# EAGLE design PCB-BI16-466 (EAGLE 7.5.0)

## Sheet 1 of 2
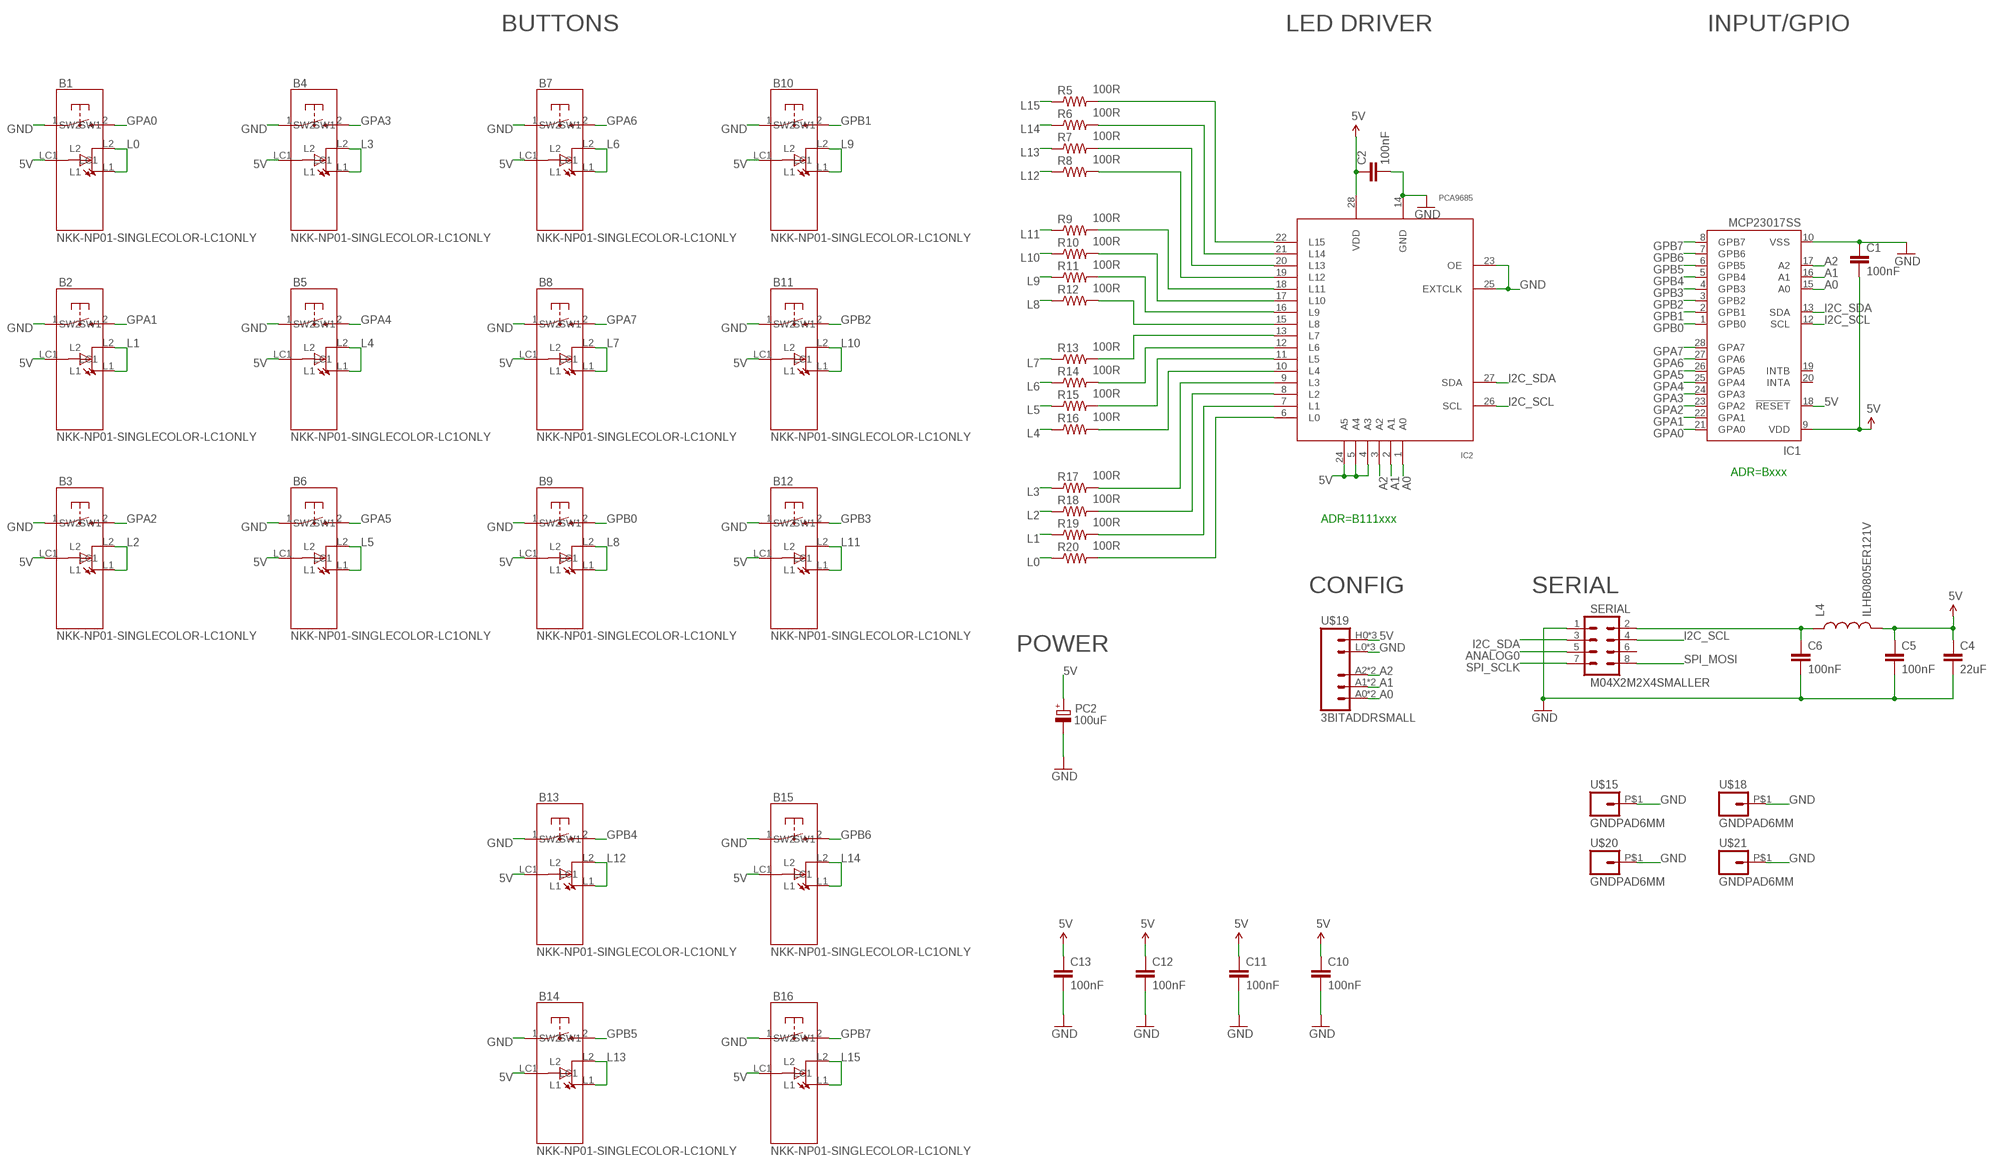
[diagram p0: schematic, sheet 1]

### Parts
B1  NKK-NP01-SINGLECOLOR-LC1ONLY  [NKK-NP01_LESSHOLES2]
B2  NKK-NP01-SINGLECOLOR-LC1ONLY  [NKK-NP01_LESSHOLES2]
B3  NKK-NP01-SINGLECOLOR-LC1ONLY  [NKK-NP01_LESSHOLES2]
B4  NKK-NP01-SINGLECOLOR-LC1ONLY  [NKK-NP01_LESSHOLES2]
B5  NKK-NP01-SINGLECOLOR-LC1ONLY  [NKK-NP01_LESSHOLES2]
B6  NKK-NP01-SINGLECOLOR-LC1ONLY  [NKK-NP01_LESSHOLES2]
B7  NKK-NP01-SINGLECOLOR-LC1ONLY  [NKK-NP01_LESSHOLES2]
B8  NKK-NP01-SINGLECOLOR-LC1ONLY  [NKK-NP01_LESSHOLES2]
B9  NKK-NP01-SINGLECOLOR-LC1ONLY  [NKK-NP01_LESSHOLES2]
B10  NKK-NP01-SINGLECOLOR-LC1ONLY  [NKK-NP01_LESSHOLES2]
B11  NKK-NP01-SINGLECOLOR-LC1ONLY  [NKK-NP01_LESSHOLES2]
B12  NKK-NP01-SINGLECOLOR-LC1ONLY  [NKK-NP01_LESSHOLES2]
B13  NKK-NP01-SINGLECOLOR-LC1ONLY  [NKK-NP01_LESSHOLES2]
B14  NKK-NP01-SINGLECOLOR-LC1ONLY  [NKK-NP01_LESSHOLES2]
B15  NKK-NP01-SINGLECOLOR-LC1ONLY  [NKK-NP01_LESSHOLES2]
B16  NKK-NP01-SINGLECOLOR-LC1ONLY  [NKK-NP01_LESSHOLES2]
C1  100nF  CAP0603-CAP  [0603-CAP]
C2  100nF  CAP0603-CAP  [0603-CAP]
C4  22uF  CAP0805  [0805]
C5  100nF  CAP0603-CAP  [0603-CAP]
C6  100nF  CAP0603-CAP  [0603-CAP]
C10  100nF  CAP0603-CAP  [0603-CAP]
C11  100nF  CAP0603-CAP  [0603-CAP]
C12  100nF  CAP0603-CAP  [0603-CAP]
C13  100nF  CAP0603-CAP  [0603-CAP]
IC1  MCP23017SS  [SSOP28]
IC2  PCA9685  [TSSOP28]
L4  ILHB0805ER121V  INDUCTOR0805  [0805]
PC2  100uF  CPOL-EUD  [PANASONIC_D]
R5  100R  RESISTOR0603-RES  [0603-RES]
R6  100R  RESISTOR0603-RES  [0603-RES]
R7  100R  RESISTOR0603-RES  [0603-RES]
R8  100R  RESISTOR0603-RES  [0603-RES]
R9  100R  RESISTOR0603-RES  [0603-RES]
R10  100R  RESISTOR0603-RES  [0603-RES]
R11  100R  RESISTOR0603-RES  [0603-RES]
R12  100R  RESISTOR0603-RES  [0603-RES]
R13  100R  RESISTOR0603-RES  [0603-RES]
R14  100R  RESISTOR0603-RES  [0603-RES]
R15  100R  RESISTOR0603-RES  [0603-RES]
R16  100R  RESISTOR0603-RES  [0603-RES]
R17  100R  RESISTOR0603-RES  [0603-RES]
R18  100R  RESISTOR0603-RES  [0603-RES]
R19  100R  RESISTOR0603-RES  [0603-RES]
R20  100R  RESISTOR0603-RES  [0603-RES]
SERIAL  M04X2M2X4SMALLER  [M2X4SMALLER]
U$15  GNDPAD6MM  [3.2MMPAD6MM]
U$18  GNDPAD6MM  [3.2MMPAD6MM]
U$19  3BITADDRSMALL  [3BITADDR_SMALL]
U$20  GNDPAD6MM  [3.2MMPAD6MM]
U$21  GNDPAD6MM  [3.2MMPAD6MM]

### Nets
5V [Power]: B1.LC1 B2.LC1 B3.LC1 B4.LC1 B5.LC1 B6.LC1 B7.LC1 B8.LC1 B9.LC1 B10.LC1 B11.LC1 B12.LC1 B13.LC1 B14.LC1 B15.LC1 B16.LC1 C1.2 C2.1 C4.1 C5.1 C10.1 C11.1 C12.1 C13.1 IC1.9(VDD) IC1.18(!RESET) IC2.4(A3) IC2.5(A4) IC2.24(A5) IC2.28(VDD) L4.2 PC2.+ U$19.H0(VCC) U$19.H1(VCC) U$19.H2(VCC)
A0: IC1.15(A0) IC2.1(A0) U$19.A0 U$19.AS0(A0)
A1: IC1.16(A1) IC2.2(A1) U$19.A1 U$19.AS1(A1)
A2: IC1.17(A2) IC2.3(A2) U$19.A2 U$19.AS2(A2)
ANALOG0: SERIAL.5
GND [Power]: B1.1(SW1) B2.1(SW1) B3.1(SW1) B4.1(SW1) B5.1(SW1) B6.1(SW1) B7.1(SW1) B8.1(SW1) B9.1(SW1) B10.1(SW1) B11.1(SW1) B12.1(SW1) B13.1(SW1) B14.1(SW1) B15.1(SW1) B16.1(SW1) C1.1 C2.2 C4.2 C5.2 C6.2 C10.2 C11.2 C12.2 C13.2 IC1.10(VSS) IC2.14(GND) IC2.23(OE) IC2.25(EXTCLK) PC2.- SERIAL.1 U$15.P$1 U$18.P$1 U$19.L0(GND) U$19.L1(GND) U$19.L2(GND) U$20.P$1 U$21.P$1
GPA0: B1.2(SW2) IC1.21(GPA0)
GPA1: B2.2(SW2) IC1.22(GPA1)
GPA2: B3.2(SW2) IC1.23(GPA2)
GPA3: B4.2(SW2) IC1.24(GPA3)
GPA4: B5.2(SW2) IC1.25(GPA4)
GPA5: B6.2(SW2) IC1.26(GPA5)
GPA6: B7.2(SW2) IC1.27(GPA6)
GPA7: B8.2(SW2) IC1.28(GPA7)
GPB0 [Power]: B9.2(SW2) IC1.1(GPB0)
GPB1: B10.2(SW2) IC1.2(GPB1)
GPB2: B11.2(SW2) IC1.3(GPB2)
GPB3: B12.2(SW2) IC1.4(GPB3)
GPB4: B13.2(SW2) IC1.5(GPB4)
GPB5: B14.2(SW2) IC1.6(GPB5)
GPB6: B15.2(SW2) IC1.7(GPB6)
GPB7: B16.2(SW2) IC1.8(GPB7)
I2C_SCL: IC1.12(SCL) IC2.26(SCL) SERIAL.4
I2C_SDA: IC1.13(SDA) IC2.27(SDA) SERIAL.3
L0: B1.L1 B1.L2 R20.1
L1: B2.L1 B2.L2 R19.1
L2: B3.L1 B3.L2 R18.1
L3: B4.L1 B4.L2 R17.1
L4: B5.L1 B5.L2 R16.1
L5: B6.L1 B6.L2 R15.1
L6: B7.L1 B7.L2 R14.1
L7: B8.L1 B8.L2 R13.1
L8: B9.L1 B9.L2 R12.1
L9: B10.L1 B10.L2 R11.1
L10: B11.L1 B11.L2 R10.1
L11: B12.L1 B12.L2 R9.1
L12: B13.L1 B13.L2 R8.1
L13: B14.L1 B14.L2 R7.1
L14: B15.L1 B15.L2 R6.1
L15: B16.L1 B16.L2 R5.1
N$1 [Power]: C6.1 L4.1 SERIAL.2
N$4: IC2.13(L7) R13.2
N$5: IC2.12(L6) R14.2
N$7: IC2.11(L5) R15.2
N$9: IC2.10(L4) R16.2
N$10: IC2.9(L3) R17.2
N$11: IC2.8(L2) R18.2
N$12: IC2.7(L1) R19.2
N$19: IC2.6(L0) R20.2
N$20: IC2.15(L8) R12.2
N$21: IC2.16(L9) R11.2
N$22: IC2.17(L10) R10.2
N$23: IC2.18(L11) R9.2
N$24: IC2.19(L12) R8.2
N$25: IC2.20(L13) R7.2
N$26: IC2.21(L14) R6.2
N$27: IC2.22(L15) R5.2
SPI_MOSI: SERIAL.8
SPI_SCLK: SERIAL.7
Unconnected: IC1.19(INTB) IC1.20(INTA) SERIAL.6

### Notes on the sheet
- BUTTONS | LED DRIVER | INPUT/GPIO
- ADR=Bxxx
- ADR=B111xxx
- CONFIG | SERIAL
- POWER

## Sheet 2 of 2

## Library data of the parts
B1-B16 = SKAARHOJ:NKK-NP01-SINGLECOLOR-LC1ONLY
C1 C2 C4-C6 C10-C13 = SparkFun:CAP: Capacitor Standard 0603 ceramic capacitor, and 0.1" leaded capacitor.
IC1 = microchip:MCP23017: http://ww1.microchip.com/downloads/en/DeviceDoc/21952a.pdf Source: http://ww1.microchip.com/downloads/en/DeviceDoc/21952a.pdf; MF: MICROCHIP; MPN: MCP23017-E/SS; OC_FARNELL: 1467674; OC_NEWARK: 31K2960
IC2 = wsmith:PCA9685
L4 = SparkFun:INDUCTOR: Inductors Basic Inductor/Choke - 0603 and 1206. Footprints are not proven and vary greatly between part numbers.
PC2 = rcl:CPOL-EU: POLARIZED CAPACITOR, European symbol
R5-R20 = SparkFun:RESISTOR: Resistor Basic schematic elements and footprints for 0603, 1206, and PTH resistors.
SERIAL = SKAARHOJ:M04X2
U$15 U$18 U$20 U$21 = SKAARHOJ:GNDPAD
U$19 = SKAARHOJ:3BITADDR

## Net classes
0 default: width 0.203 mm, drill 0.305 mm, clearance 0.203 mm
1 Power: width 0.406 mm, drill 0.61 mm, clearance 0.254 mm

## Board
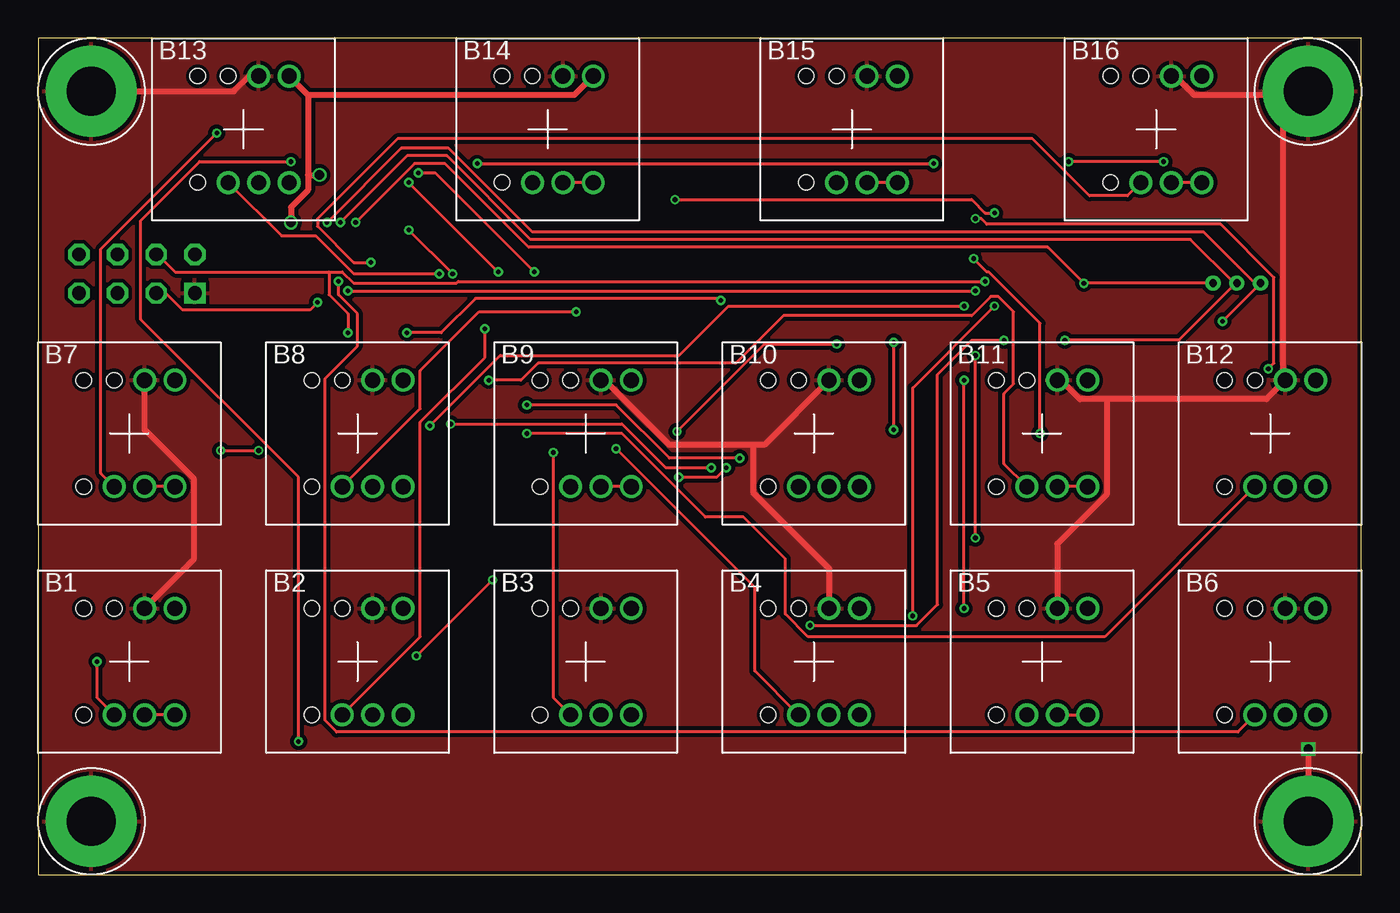
[diagram p1: board, top side]
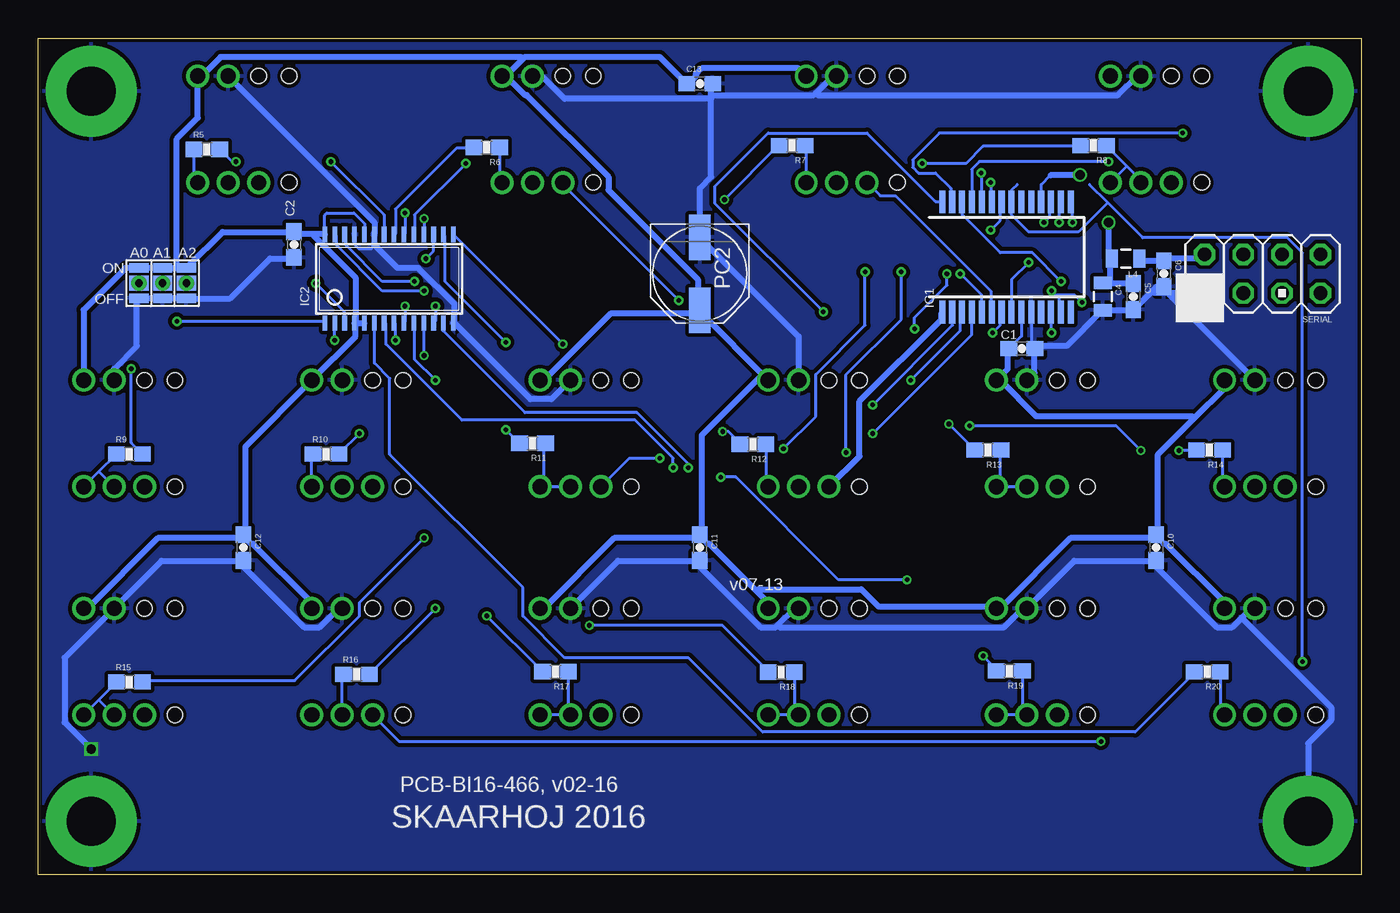
[diagram p2: board, bottom side, seen from below]

Size 87 x 55 mm. Coordinates in mm from the lower left corner, seen from the top.
Outline: 0,0 87,0 87,55 0,55 0,0
Copper layers (1*16): Top 0.035mm / dielectric 1.5mm / Bottom 0.035mm
Design rules "Fusion_eagle_rule_v1.1": minimum track width 6mil, minimum drill 12mil, track to track 6mil, track to pad 6mil, pad to pad 6mil, via to via 6mil, smd to smd 0mil, copper to edge 10mil, drill to drill 10mil, minimum pad ring 10mil, minimum via ring 6mil, stop-mask expansion 2mil, vias tented up to drill 100mil, thermal gap 10mil

### Footprints (pad centres in the part's own frame; a part is rotated, then mirrored left to right if it is on the bottom)
NKK-NP01_LESSHOLES2 = drill 1: 1 1,3.5; 2 -1,-3.5; L1 3,-3.5; L2 1,-3.5; LC1 3,3.5 | hole 1: -3,3.5; -3,-3.5; -1,3.5
0603-CAP = smd 1.1 x 1: 1 -0.85,0; 2 0.85,0
0805 = smd 0.8 x 1.2: 1 -0.9,0; 2 0.9,0
SSOP28 = smd 0.4 x 1.5: 1 -4.225,-3.625; 2 -3.575,-3.625; 3 -2.925,-3.625; 4 -2.275,-3.625; 5 -1.625,-3.625; 6 -0.975,-3.625; 7 -0.325,-3.625; 8 0.325,-3.625; 9 0.975,-3.625; 10 1.625,-3.625; 11 2.275,-3.625; 12 2.925,-3.625; 13 3.575,-3.625; 14 4.225,-3.625; 15 4.225,3.625; 16 3.575,3.625; 17 2.925,3.625; 18 2.275,3.625; 19 1.625,3.625; 20 0.975,3.625; 21 0.325,3.625; 22 -0.325,3.625; 23 -0.975,3.625; 24 -1.625,3.625; 25 -2.275,3.625; 26 -2.925,3.625; 27 -3.575,3.625; 28 -4.225,3.625
TSSOP28 = smd 0.305 x 0.991: 1 -4.225,-2.918; 2 -3.575,-2.918; 3 -2.925,-2.918; 4 -2.275,-2.918; 5 -1.625,-2.918; 6 -0.975,-2.918; 7 -0.325,-2.918; 8 0.325,-2.918; 9 0.975,-2.918; 10 1.625,-2.918; 11 2.275,-2.918; 12 2.925,-2.918; 13 3.575,-2.918; 14 4.225,-2.918; 15 4.225,2.918; 16 3.575,2.918; 17 2.925,2.918; 18 2.275,2.918; 19 1.625,2.918; 20 0.975,2.918; 21 0.325,2.918; 22 -0.325,2.918; 23 -0.975,2.918; 24 -1.625,2.918; 25 -2.275,2.918; 26 -2.925,2.918; 27 -3.575,2.918; 28 -4.225,2.918
PANASONIC_D = smd 3 x 1.4: + 2.4,0; - -2.4,0
0603-RES = smd 1.1 x 1: 1 -0.85,0; 2 0.85,0
M2X4SMALLER = drill 0.9 square: 1 -1.27,3.81 | drill 0.9 octagon: 2 1.27,3.81; 3 -1.27,1.27; 4 1.27,1.27; 5 -1.27,-1.27; 6 1.27,-1.27; 7 -1.27,-3.81; 8 1.27,-3.81
3.2MMPAD6MM = drill 3.2 pad 6: P$1 0,0
3BITADDR_SMALL = drill 0.5: A0 -1.565,0; A1 0,0; A2 1.565,0 | smd 1.27 x 1: AS0 -1.565,0; AS1 0,0; AS2 1.565,0 | smd 1.27 x 0.635: H0 -1.565,1; H1 0,1; H2 1.565,1; L0 -1.565,-1; L1 0,-1; L2 1.565,-1

### Placement (x,y rotation side)
B1  6,14 0 top
B2  21,14 0 top
B3  36,14 0 top
B4  51,14 0 top
B5  66,14 0 top
B6  81,14 0 top
B7  6,29 0 top
B8  21,29 0 top
B9  36,29 0 top
B10  51,29 0 top
B11  66,29 0 top
B12  81,29 0 top
B13  13.5,49 0 top
B14  33.5,49 0 top
B15  53.5,49 0 top
B16  73.5,49 0 top
C1  22.33,34.58 180 bottom
C2  70.18,41.42 270 bottom
C4  17,38 270 bottom
C5  15,38 270 bottom
C6  13,39.5 270 bottom
C10  13.5,21.5 270 bottom
C11  43.5,21.5 270 bottom
C12  73.5,21.5 270 bottom
C13  43.5,52 0 bottom
IC1  23.33,40.6 0 bottom
IC2  63.92,39.17 0 bottom
L4  15.5,40.5 180 bottom
PC2  43.5,39.5 270 bottom
R5  75.9,47.68 0 bottom
R6  57.51,47.8 180 bottom
R7  37.43,47.93 180 bottom
R8  17.61,47.93 180 bottom
R9  80.99,27.64 0 bottom
R10  68.07,27.64 0 bottom
R11  54.49,28.36 180 bottom
R12  40.01,28.28 180 bottom
R13  24.56,27.91 180 bottom
R14  9.99,27.91 180 bottom
R15  80.99,12.66 0 bottom
R16  66.07,13.16 0 bottom
R17  52.99,13.34 180 bottom
R18  38.15,13.31 180 bottom
R19  23.14,13.38 180 bottom
R20  10.14,13.33 180 bottom
SERIAL  6.5,39.5 90 bottom
U$15  3.5,3.5 0 top
U$18  83.5,3.5 0 top
U$19  78.81,38.89 0 bottom
U$20  3.5,51.5 0 top
U$21  83.5,51.5 0 top

### Tracks (layer width: path | path; a pad name or v marks a point on that pad's centre or on a via)
5V  (via drill 0.61)
  Top 0.406: v16.62,42.88 16.62,43.88 17.75,45 17.75,46 | 17.75,51.25 17.75,46 | B13.LC1 17.75,51.25 | 17.75,51.25 35.25,51.25 B14.LC1 | 17.75,46 v18.5,46
  Bottom 0.203: IC2.28 68.15,43.35 68,43.5 66.23,43.5 65.53,42.8 65.53,42.1 IC2.24 | IC1.9 22.36,35.4 C1.2 | IC1.18 21.06,45.37 20.45,45.97
  Bottom 0.406: C1.2 23.25,34.5 23.25,33.25 B8.LC1 23.75,32.5 21.38,30.12 11.12,30.12 11,30 | B1.LC1 9,17.88 12.88,21.75 13,21.75 13.5,22.25 C10.1 | C10.1 13.62,22.12 19.12,22.12 23.75,17.5 B2.LC1 24.12,17.62 31.75,17.62 32.88,18.75 39.62,18.75 39.75,18.62 | B7.LC1 9,32 11,30 | 11,30 13.38,27.62 13.38,22.5 C10.1 | 39.75,18.62 39,17.88 B3.LC1 | 39.75,18.62 42.88,21.75 43,21.75 43.5,22.25 C11.1 | B4.LC1 53.75,17.5 49.12,22.12 43.62,22.12 C11.1 | PC2.+ 43.5,37 B9.LC1 39.5,32.75 43.38,28.88 43.38,22.5 C11.1 | B10.LC1 53.75,32.5 49.38,36.88 43.62,36.88 PC2.+ | B5.LC1 69,17.88 72.88,21.75 73,21.75 73.5,22.25 C12.1 | B6.LC1 83.75,17.5 79.12,22.12 73.62,22.12 C12.1 | IC2.5 65.62,36.25 66.12,36.25 IC2.4 | IC2.4 66.12,36.12 66.12,35.38 B11.LC1 73.38,28.12 73.38,22.5 C12.1 | 68.88,42.12 70,42.12 70.12,42.25 C2.1 70.38,42.25 74.88,42.25 77.12,40 U$19.H2 | 68.88,42.12 68.25,42.12 IC2.28 | U$19.H2 77.25,39.88 78.75,39.88 U$19.H1 79,39.88 80.38,39.88 U$19.H0 80.5,39.88 81.25,39.88 84,37.12 B12.LC1 | U$19.H2 77.88,40 77.88,48.38 76.5,49.75 B16.LC1 76.38,52.62 76.12,52.62 75,53.75 55.25,53.75 55.12,53.62 | IC2.4 66.12,36.38 66.12,39.25 68.88,42 68.88,42.12 | C5.1 15,38.88 17,38.88 C4.1 16.5,39 16.5,40.5 L4.2 16.62,40.62 v16.62,42.88 | B14.LC1 37,53 43.38,53 43.75,52.62 43.75,52.5 44.25,52 C13.1 44.5,52.12 46.12,53.75 55,53.75 55.12,53.62 | 55.12,53.62 56.25,52.5 B15.LC1 56.12,52.38 55,51.25 54.88,51.25 49.5,45.88 49.5,45 43.62,39.12 43.62,37.25 PC2.+ | v18.5,46 20.38,46 20.45,45.97
A0  (via drill 0.3)
  Top 0.203: v77.88,36.38 80.38,38.88 U$19.AS0 80.12,38.75 76.62,42.25 32.5,42.25 27,47.75 23.88,47.75 v19,42.88
  Bottom 0.203: v77.88,36.38 68.25,36.38 IC2.1 | 80.38,39 U$19.AS0 | v19,42.88 19,44.12 IC1.15
A1  (via drill 0.3)
  Top 0.203: v67.5,35.12 75,35.12 78.75,38.88 U$19.AS1 78.62,38.88 75.75,41.75 32.38,41.75 26.88,47.25 24.25,47.25 v19.88,42.88
  Bottom 0.203: v67.5,35.12 IC2.2 | 78.88,39 U$19.AS1 | v19.88,42.88 19.88,44.12 IC1.16
A2  (via drill 0.3)
  Top 0.203: U$19.AS2 77.12,38.88 v68.75,38.88 66.38,41.25 32.25,41.25 26.75,46.75 24.75,46.75 v20.88,42.88
  Bottom 0.203: v68.75,38.88 66.88,37 66.88,36.38 IC2.3 | 77.25,39 U$19.AS2 | v20.88,42.88 20.5,43.25 20.5,44.12 IC1.17
GND  (via drill 0.6)
  Top 0.406: B7.1 7,29.25 10.25,26 10.25,20.75 B1.1 | B13.1 13.88,52.5 12.88,51.5 U$20.P$1 | B16.1 74.75,52.5 76,51.25 83.25,51.25 U$21.P$1 81.88,51.12 81.88,32.62 B12.1 80.75,31.25 70.25,31.25 | B11.1 67.25,32.5 68.5,31.25 70.25,31.25 | B5.1 67,21.75 70.25,25 70.25,31.25 | v83.5,8.25 U$18.P$1 | B9.1 37.25,32.5 41.5,28.25 47,28.25 | 47,28.25 47.75,28.25 B10.1 | B4.1 52,20.12 47,25.12 47,28.25
  Bottom 0.203: IC1.10 21.71,34.81 C1.1 | IC2.25 66.2,41.43 65.91,41.15 65.1,41.15 64.88,41.38
  Bottom 0.406: B8.1 21.5,33 21.5,34.5 C1.1 21.38,34.75 19.38,34.75 17.12,37 C4.2 17,37.12 15,37.12 C5.2 14.88,37.25 13.75,38.38 | 13.75,38.38 13.5,38.62 13,38.62 C6.2 12.62,38.12 B7.1 | SERIAL.1 10.38,38.25 13.62,38.25 13.75,38.38 | B1.1 7.25,17.5 7.88,16.88 | 7.88,16.88 8.5,16.25 9.5,16.25 13.75,20.5 C10.2 13.5,20.62 18.88,20.62 B2.1 22.12,17.38 22.38,17.38 23.5,16.25 38.25,16.25 38.38,16.38 | B4.1 48.88,20.62 43.5,20.62 C11.2 43.75,20.5 39.5,16.25 38.5,16.25 38.38,16.38 | B3.1 37.25,17.5 38.38,16.38 | U$15.P$1 3.5,8.62 2,10.12 2,11 7.88,16.88 | 42.75,51 42.75,45.88 43.5,45.12 PC2.- 43.38,41.75 37,35.38 B9.1 | 42.75,51 42.75,51.25 | 42.75,51.25 42.75,52 C13.2 | B14.1 34.75,52.5 35.88,51.38 | 35.88,51.38 36,51.25 42.75,51.25 | B15.1 53.88,52.5 52.38,51 42.75,51 | B13.1 14.75,52.5 16,51.25 35.75,51.25 35.88,51.38 | B10.1 53.25,31.25 54.62,31.25 59.62,36.25 IC2.14 59.62,36.38 59.62,37.5 62,39.88 63.38,39.88 64.88,41.38 64.88,42 IC2.23 64.88,42.25 64.88,42.88 B16.1 | B5.1 67.25,17.5 68.5,16.25 69.5,16.25 73.75,20.5 C12.2 73.5,20.62 78.88,20.62 B6.1 85.25,14.25 85.25,10 v83.5,8.25 | C2.2 70.25,40.5 71.75,40.5 74.38,37.88 77.12,37.88 U$19.L2 77.38,37.88 78.75,37.88 U$19.L1 79,37.88 80.38,37.88 U$19.L0 80.5,37.75 80.5,34.75 82,33.25 B12.1
  pour Top: 0,0 87,0 87,55 0,55
  pour Bottom: 0,0 87,0 87,55 0,55
GPA0  (via drill 0.3)
  Top 0.203: v3.88,14 3.88,11.62 B1.2
  Bottom 0.203: 22.62,45.38 23,45 23,44.25 IC1.21 23,44.12 23,43.38 21.88,42.25 18.62,42.25 16.69,44.19 | 16.69,44.19 14.38,41.88 4.88,41.88 3.88,40.88 v3.88,14 | 16.69,44.19 17.88,45.38
GPA1  (via drill 0.3)
  Top 0.203: v27.25,39.5 v24.38,42.38 | v29.38,35.88 29.38,34 25.12,29.75 25.12,15.62 B2.2
  Bottom 0.203: v24.38,42.38 23.75,43 23.75,44.12 IC1.22 | v27.25,39.5 27.25,38.75 29.38,36.62 v29.38,35.88
GPA2  (via drill 0.3)
  Top 0.203: v30.25,39.62 v24.38,45.5 | v33.88,27.75 33.88,11.62 B3.2
  Bottom 0.203: v24.38,45.5 24.38,44.25 IC1.23 | v30.25,39.62 30.25,36.5 33.88,32.88 v33.88,27.75
GPA3  (via drill 0.3)
  Top 0.203: v25,46.12 26.12,46.12 v32.62,39.62 | v38,28 47.12,18.88 47.12,13.38 B4.2
  Bottom 0.203: v25,46.12 25,44.25 IC1.24 | v32.62,39.62 32.62,36.12 35.88,32.88 35.88,30.12 v38,28
GPA4  (via drill 0.3)
  Top 0.203: v16.62,46.88 10.62,46.88 6.75,43 6.75,36.5 17.12,26.12 v17.12,8.75
  Bottom 0.203: v16.62,46.88 25.12,46.88 25.62,46.38 25.62,44.25 IC1.25 | v17.12,8.75 63.25,8.75 B5.2
GPA5  (via drill 0.3)
  Top 0.203: v19.75,39 19.75,38.12 21,36.88 21,34.75 18.88,32.62 18.88,10.12 19.62,9.38 78.88,9.38 B6.2
  Bottom 0.203: v19.75,39 21.62,40.88 23.75,40.88 26.25,43.38 26.25,44.12 IC1.26
GPA6  (via drill 0.3)
  Top 0.203: v11.75,48.75 4.12,41.12 4.12,26.38 B7.2
  Bottom 0.203: v11.75,48.75 27.75,48.75 29.5,47 29.5,46.5 29.12,46.12 28,46.12 27,45.12 27,44.25 IC1.27
GPA7  (via drill 0.3)
  Top 0.203: v35.38,37 29,37 25.12,33.12 25.12,30.62 B8.2
  Bottom 0.203: v35.38,37 42.5,44.12 42.5,45.25 39,48.75 32.5,48.75 28,44.25 27.62,44.25 IC1.28
GPB0
  Bottom 0.406: B9.2 33,27.5 33,31.12 27.62,36.5 27.62,36.88 IC1.1
GPB1  (via drill 0.3)
  Top 0.203: v32.12,30.88 38,30.88 41.5,27.38 v46.12,27.38
  Bottom 0.203: v32.12,30.88 26.88,36.12 26.88,36.88 IC1.2 | v46.12,27.38 48.12,27.38 B10.2
GPB2  (via drill 0.3)
  Top 0.203: v29.62,32.5 31.75,32.5 32.88,33.62 45.88,33.62 49,36.75 61.38,36.75 62.62,38 63.12,38 64.12,37 64.12,32.25 63.5,31.62 63.5,27 B11.2
  Bottom 0.203: v29.62,32.5 26.38,35.75 26.38,36.88 IC1.3
GPB3  (via drill 0.3)
  Top 0.203: v32.12,29 38.38,29 43.88,23.5 46.38,23.5 49.12,20.75 49.12,17.12 50.62,15.62 70.12,15.62 B12.2
  Bottom 0.203: v32.12,29 25.62,35.5 25.62,36.88 IC1.4
GPB4  (via drill 0.3)
  Top 0.203: v26.38,39.5 20.75,39.5 18.25,42 16,42 B13.2
  Bottom 0.203: v26.38,39.5 25,38.12 25,37 IC1.5
GPB5
  Bottom 0.203: B14.2 31.62,44.62 30.62,44.62 24.38,38.38 24.38,37 IC1.6
GPB6  (via drill 0.3)
  Top 0.203: v24.25,35.62 26.5,35.62 28.75,37.88 44.75,37.88 v44.88,37.75
  Bottom 0.203: v24.25,35.62 23.75,36.12 23.75,36.88 IC1.7 | v44.88,37.75 52.5,45.38 B15.2
GPB7  (via drill 0.3)
  Top 0.203: v21.88,40.25 20.75,40.25 18.38,42.62 18.38,43.12 23.62,48.38 65.38,48.38 69.12,44.62 71.62,44.62 B16.2
  Bottom 0.203: v21.88,40.25 23,39.12 23,37 IC1.8
I2C_SCL  (via drill 0.3)
  Top 0.203: v62.25,39 27.62,39 27.5,38.88 20.75,38.88 20,39.62 19.12,39.62 | 19.12,39.62 9,39.62 7.88,40.75 SERIAL.4 | v20.38,35.62 20.38,36.88 19.12,38.12 19.12,39.62
  Bottom 0.203: v62.25,39 64.38,39 66.75,41.38 66.75,42 IC2.26 | v20.38,35.62 20.38,36.88 IC1.12
I2C_SDA  (via drill 0.3)
  Top 0.203: v20.38,38.38 v61.62,38.38 | v18.38,37.62 17.88,37.12 9.5,37.12 8.5,38.12 7.88,38.12 SERIAL.3
  Bottom 0.203: v61.62,38.38 64.38,38.38 67.38,41.38 67.38,42 IC2.27 | 20.06,38.06 19.88,37.88 19.88,37 IC1.13 | 20.06,38.06 v20.38,38.38 | v18.38,37.62 18.88,38.12 20,38.12 20.06,38.06
L0
  Top 0.203: B1.L1 B1.L2
  Bottom 0.203: B1.L1 9.25,10.75 9.25,13.25 R20.1
L1
  Bottom 0.203: R19.1 22.25,13.38 22.25,10.75 B2.L2 B2.L1
L2
  Bottom 0.203: R18.1 37.25,13.25 37.25,10.75 B3.L2 B3.L1
L3
  Bottom 0.203: R17.1 52.12,13.25 52.12,10.62 B4.L2 B4.L1
L4
  Top 0.203: B5.L2 B5.L1
  Bottom 0.203: B5.L2 67,13.12 R16.1
L5
  Bottom 0.203: B6.L1 83,11.5 | 83,11.5 81.88,12.62 R15.1 | 83,11.5 B6.L2
L6
  Top 0.203: B7.L1 B7.L2
  Bottom 0.203: B7.L1 9.12,25.62 9.12,27.88 R14.1
L7
  Bottom 0.203: R13.1 23.75,27.88 23.75,25.75 B8.L1 B8.L2
L8
  Top 0.203: B9.L1 B9.L2
  Bottom 0.203: B9.L1 39.12,25.62 39.12,28.25 R12.1
L9
  Bottom 0.203: R11.1 53.75,28.25 53.75,25.75 B10.L1 B10.L2
L10
  Top 0.203: B11.L1 B11.L2
  Bottom 0.203: B11.L1 69,27.62 R10.1
L11
  Bottom 0.203: B12.L1 83,26.5 | 83,26.5 81.88,27.62 R9.1 | 83,26.5 B12.L2
L12
  Bottom 0.203: 15.44,46.56 14.5,45.62 B13.L2 | 15.44,46.56 16.75,47.88 R8.1 | 15.44,46.56 B13.L1
L13
  Top 0.203: B14.L1 B14.L2
  Bottom 0.203: B14.L1 36.5,47.88 R7.1
L14
  Top 0.203: B15.L1 B15.L2
  Bottom 0.203: B15.L1 56.62,45.62 56.62,47.75 R6.1
L15
  Top 0.203: B16.L1 B16.L2
  Bottom 0.203: B16.L1 76.75,45.75 76.75,47.62 R5.1
N$1
  Bottom 0.406: L4.1 14.5,40.5 14.38,40.38 13,40.38 C6.1 12.88,40.5 10.62,40.5 10.38,40.75 SERIAL.2
N$4  (via drill 0.3)
  Top 0.203: v44.25,26.75 41.25,26.75 38.38,29.62 v27.12,29.62
  Bottom 0.203: v44.25,26.75 44.25,27 47.62,30.38 55,30.38 60.38,35.75 60.38,36.25 IC2.13 | v27.12,29.62 25.5,28 R13.2
N$5  (via drill 0.3)
  Top 0.203: v60.88,37.38 45.38,37.38 42.12,34.12 30.38,34.12 v25.75,29.5 | v12,27.88 v14.5,27.88
  Bottom 0.203: v60.88,37.38 60.88,36.38 IC2.12 | v25.75,29.5 16.12,29.5 v14.5,27.88 | v12,27.88 10.88,27.88 R14.2
N$7  (via drill 0.3)
  Top 0.203: v61.62,22.12 v61.62,34.12
  Bottom 0.203: v61.62,34.12 61.62,36.25 IC2.11 | v61.62,22.12 65.88,17.88 65.88,17 70.12,12.75 80.12,12.75 R15.2
N$9  (via drill 0.3)
  Top 0.203: v60.88,17.5 v60.88,32.5
  Bottom 0.203: v60.88,32.5 62.25,33.88 62.25,36.25 IC2.10 | v60.88,17.5 65.12,13.25 R16.2
N$10  (via drill 0.3)
  Top 0.203: v62.88,37.38 57.5,32 v57.5,17
  Bottom 0.203: v62.88,37.38 62.88,36.38 IC2.9 | v57.5,17 53.88,13.38 R17.2
N$11  (via drill 0.3)
  Top 0.203: v63.5,35.12 61.38,35.12 59.12,32.88 59.12,17.75 57.75,16.38 v50.75,16.38
  Bottom 0.203: v63.5,35.12 63.5,36.25 IC2.8 | v50.75,16.38 42,16.38 39,13.38 R18.2
N$12  (via drill 0.3)
  Top 0.203: v45.25,26.75 44.62,26.12 v42.12,26.12 | v24.88,14.38 v29.88,19.38
  Bottom 0.203: v45.25,26.75 45.25,27.38 47.75,29.88 59.12,29.88 64.12,34.88 64.12,36.25 IC2.7 | v42.12,26.12 41.12,26.12 34.38,19.38 v29.88,19.38 | v24.88,14.38 24,13.5 R19.2
N$19
  Bottom 0.203: IC2.6 64.88,36.25 64.88,33.62 63.88,32.62 63.88,27.62 55.12,18.88 55.12,17 52.38,14.25 44.25,14.25 39.38,9.38 14.88,9.38 11,13.25 R20.2
N$20  (via drill 0.3)
  Top 0.203: v52.5,34.88 47.75,34.88 v42,29.12
  Bottom 0.203: v52.5,34.88 59.62,42 IC2.15 | v42,29.12 41.62,29.12 40.88,28.38 R12.2
N$21  (via drill 0.3)
  Top 0.203: v56.25,29.25 v56.25,35
  Bottom 0.203: v56.25,35 60.25,39 60.25,42 IC2.16 | v56.25,29.25 55.38,28.38 R11.2
N$22  (via drill 0.3)
  Top 0.203: v61.5,40.5 62.38,39.62 62.5,39.62 65.88,36.25 v65.88,29
  Bottom 0.203: v61.5,40.5 61,41 61,42 IC2.17 | v65.88,29 67.12,27.75 R10.2
N$23  (via drill 0.3)
  Top 0.203: v61.62,43.12 62,43.12 62.38,42.75 77.75,42.75 81.25,39.25 81.25,33.62 v80.88,33.25
  Bottom 0.203: v61.62,43.12 61.62,42.12 IC2.18 | v80.88,33.25 80.88,28.38 80.25,27.75 R9.2
N$24  (via drill 0.3)
  Top 0.203: v28.88,46.75 v58.88,46.75
  Bottom 0.203: v58.88,46.75 62.25,43.38 62.25,42.12 IC2.19 | v28.88,46.75 26,46.75 24.88,47.88 18.5,47.88 R8.2
N$25  (via drill 0.3)
  Top 0.203: v62.88,43.5 62.25,43.5 61.38,44.38 v41.88,44.38
  Bottom 0.203: v62.88,43.5 62.88,42.12 IC2.20 | v41.88,44.38 38.38,47.88 R7.2
N$26
  Bottom 0.203: IC2.21 63.5,42.12 63.5,43.75 59.5,47.75 58.38,47.75 R6.2
N$27  (via drill 0.3)
  Top 0.203: v74,46.88 v67.75,46.88
  Bottom 0.203: v67.75,46.88 64.25,43.38 64.25,42.12 IC2.22 | v74,46.88 74.25,46.88 R5.2

### Text on the board
_bsilk: v07-13 | PCB-BI16-466, v02-16 | SKAARHOJ 2016